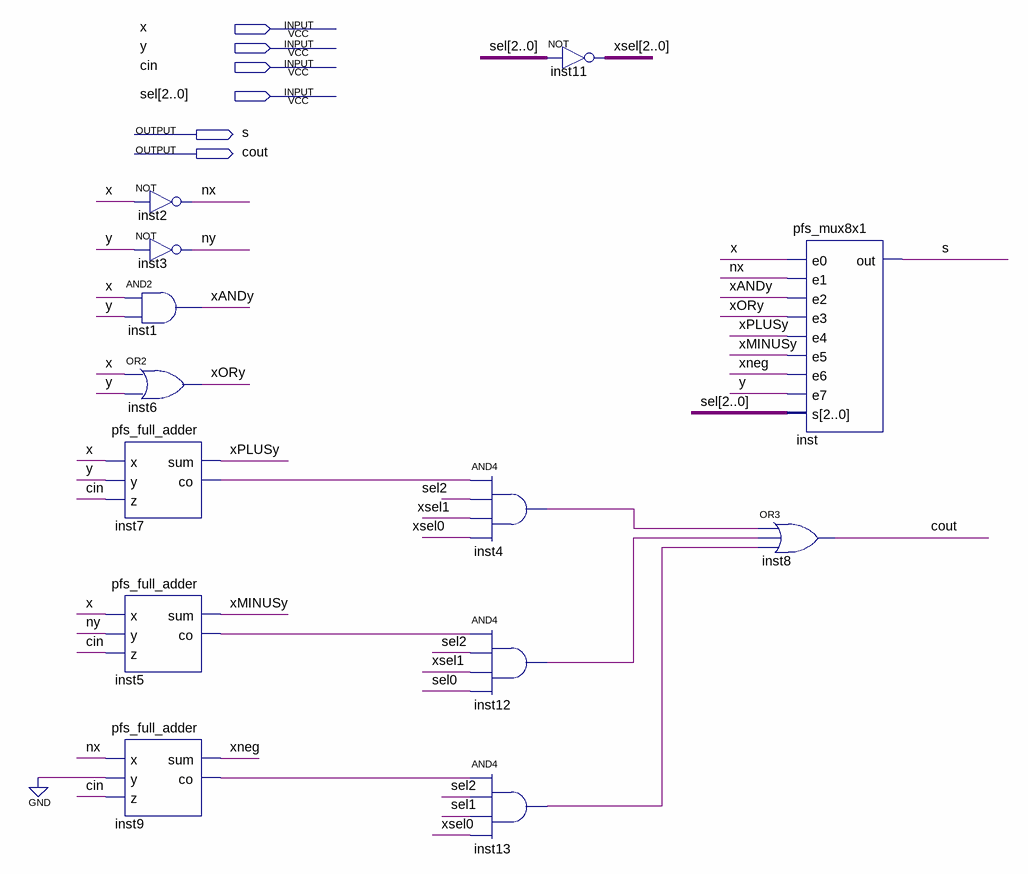
[diagram p0: schematic sheet]
// Quartus schematic pfs_ula_1bit.bdf as structural Verilog: 13 symbols, 6 pins
module pfs_ula_1bit (
  input  x,
  input  y,
  input  cin,
  input  [2:0] sel,
  output s,
  output cout
);

  wire inst4_out, inst5_co, inst7_co, inst9_co, inst12_out, inst13_out, nx, ny, xANDy, xMINUSy, xneg, xORy,
       xPLUSy;
  wire [2:0] xsel;

  pfs_full_adder inst7 (.x(x), .y(y), .z(cin), .sum(xPLUSy), .co(inst7_co));
  pfs_full_adder inst5 (.x(x), .y(ny), .z(cin), .sum(xMINUSy), .co(inst5_co));
  pfs_full_adder inst9 (.x(nx), .y(1'b0), .z(cin), .sum(xneg), .co(inst9_co));
  not inst2 (nx, x);
  not inst3 (ny, y);
  and inst1 (xANDy, x, y);
  or inst6 (xORy, x, y);
  and inst4 (inst4_out, inst7_co, sel[2], xsel[1], xsel[0]);
  and inst12 (inst12_out, inst5_co, sel[2], xsel[1], sel[0]);
  and inst13 (inst13_out, inst9_co, sel[2], sel[1], xsel[0]);
  assign xsel = ~sel;  // NOT inst11, 3 bits wide
  pfs_mux8x1 inst (
    .e0(x), .e1(nx), .e2(xANDy), .e3(xORy), .e4(xPLUSy), .e5(xMINUSy), .e6(xneg), .e7(y), .s(sel), .out(s));
  or inst8 (cout, inst4_out, inst12_out, inst13_out);
endmodule
